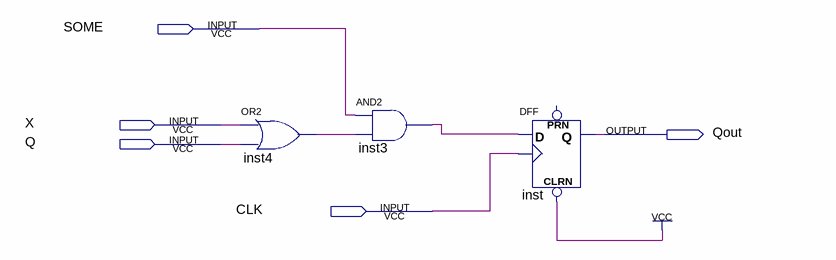
[diagram p0: schematic sheet]
// Quartus schematic resetsincr.bdf as structural Verilog: 3 symbols, 5 pins
module resetsincr (
  input  SOME,
  input  X,
  input  Q,
  input  CLK,
  output Qout
);

  wire inst3_out, inst4_out;

  or inst4 (inst4_out, X, Q);
  and inst3 (inst3_out, SOME, inst4_out);
  DFF inst (.CLRN(1'b1), .CLK(CLK), .D(inst3_out), .Q(Qout));  // open: PRN
endmodule
